# EAGLE schematic jnode_v3 (EAGLE 6.1)
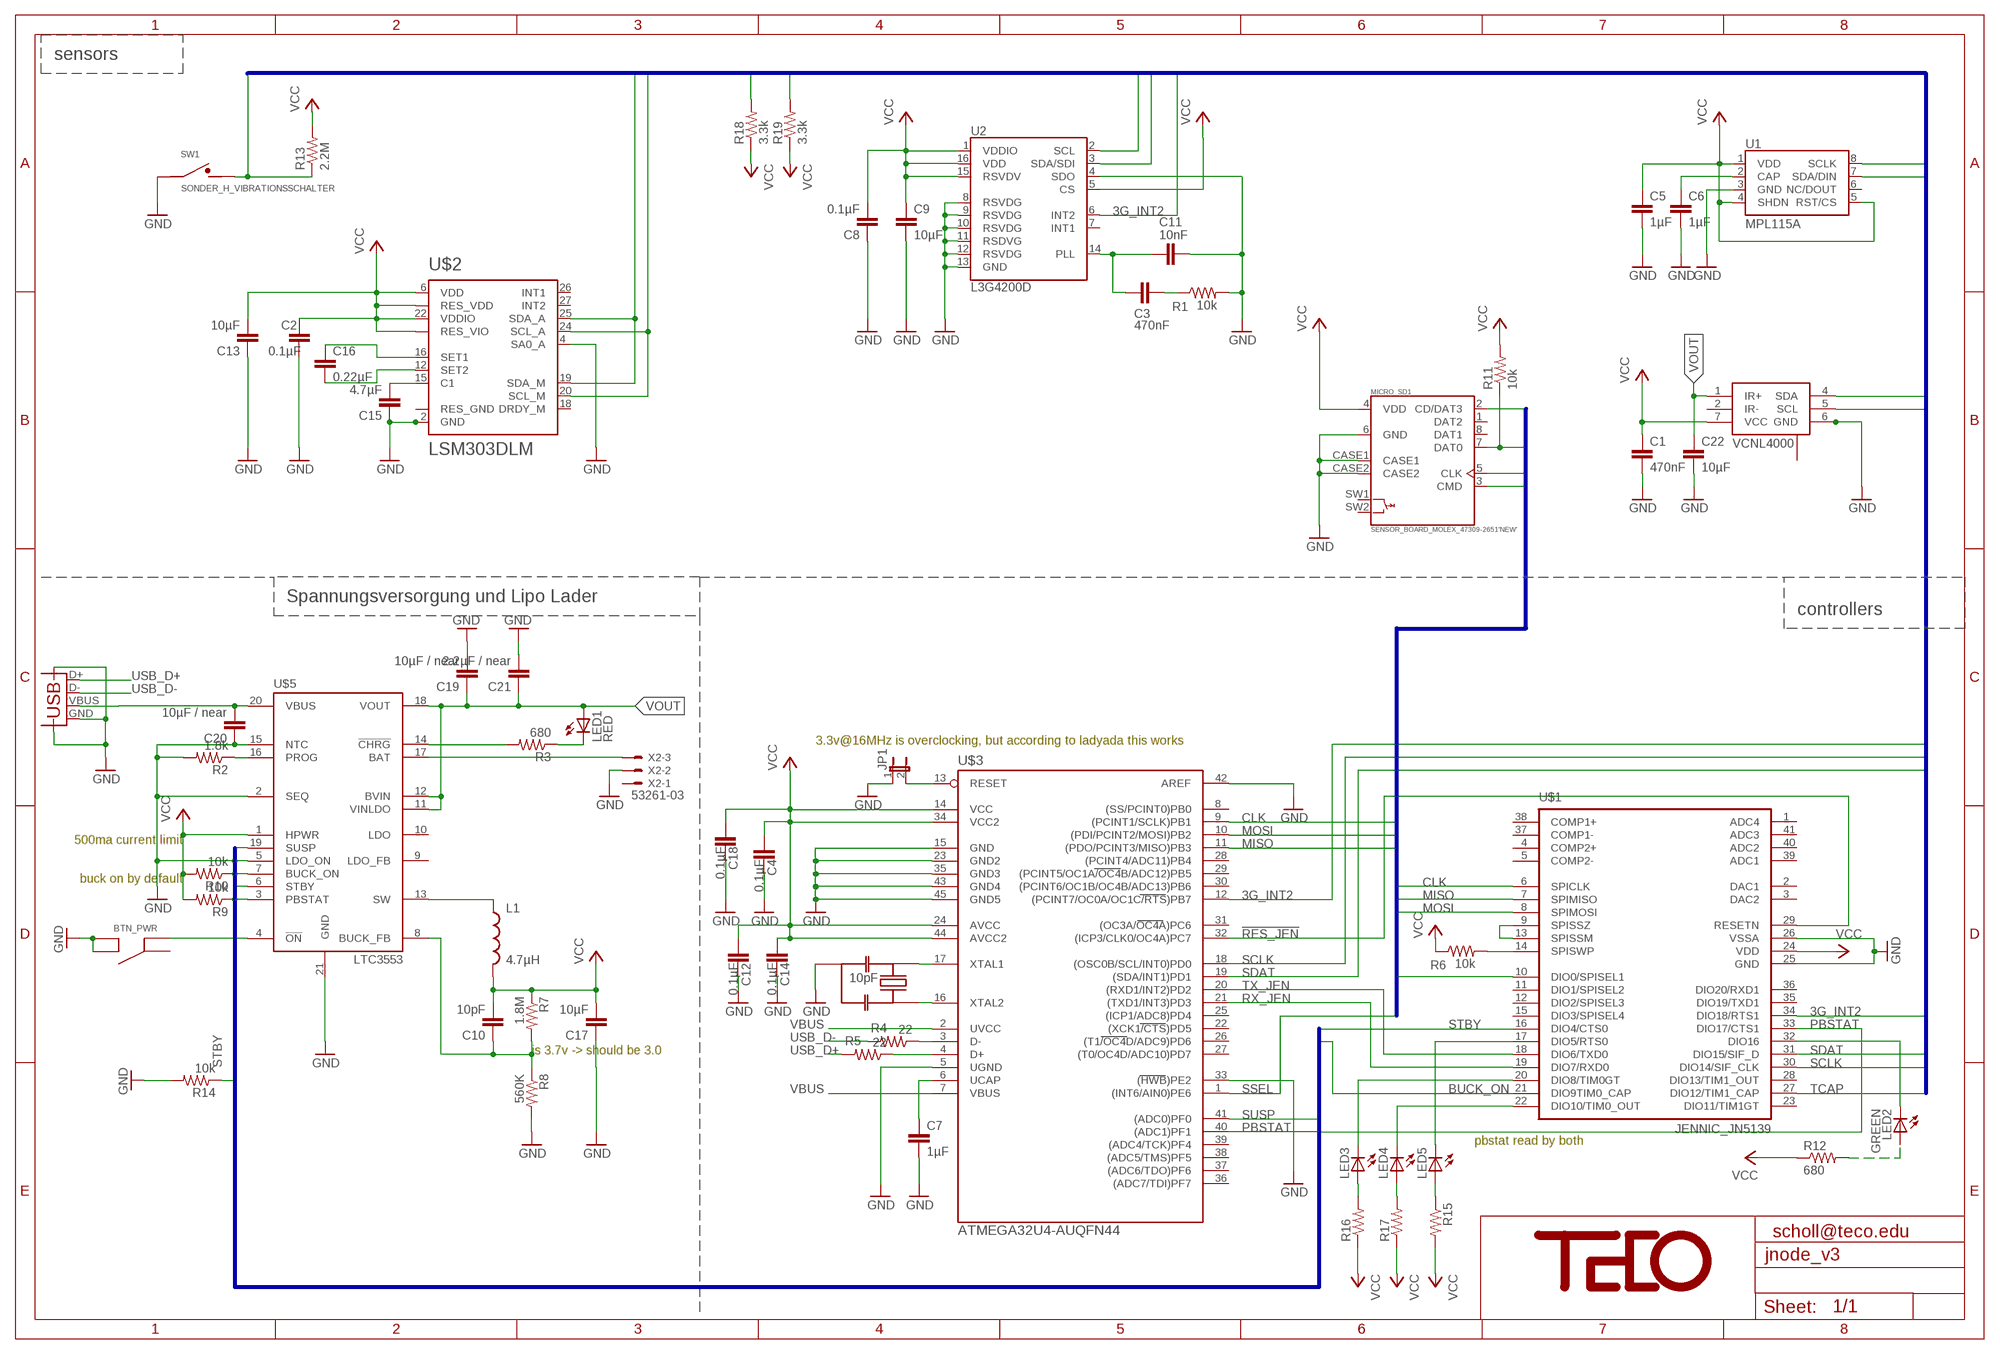
[diagram p0: schematic, sheet 1]

## Parts
BTN_PWR  TACTILE_SWITCH  [EVQ-PUK02K]
C1  470nF  CAP0402-CAP  [0402-CAP]
C2  0.1µF  CAP0402-CAP  [0402-CAP]
C3  470nF  CAP0402-CAP  [0402-CAP]
C4  0.1µF  CAP0402-CAP  [0402-CAP]
C5  1µF  CAP0402-CAP  [0402-CAP]
C6  1µF  CAP0402-CAP  [0402-CAP]
C7  1µF  CAP0402-CAP  [0402-CAP]
C8  0.1µF  CAP0402-CAP  [0402-CAP]
C9  10µF  CAP0603-CAP  [0603-CAP]
C10  10pF  CAP0402-CAP  [0402-CAP]
C11  10nF  CAP0402-CAP  [0402-CAP]
C12  0.1µF  CAP0402-CAP  [0402-CAP]
C13  10µF  CAP0603-CAP  [0603-CAP]
C14  0.1µF  CAP0402-CAP  [0402-CAP]
C15  4.7µF  CAP0402-CAP  [0402-CAP]
C16  0.22µF  CAP0402-CAP  [0402-CAP]
C17  10µF  CAP0603-CAP  [0603-CAP]
C18  0.1µF  CAP0402-CAP  [0402-CAP]
C19  10µF / near  CAP0603-CAP  [0603-CAP]
C20  10µF / near  CAP0603-CAP  [0603-CAP]
C21  2.2µF / near  CAP0402-CAP  [0402-CAP]
C22  10µF  CAP0603-CAP  [0603-CAP]
JP1  JUMPER-2SMD-NO  [SJ_2S-NO]
L1  4.7µH  SPARKFUN_INDUCTOR  [MLP2012]
LED1  RED  LEDCHIP-LED0402  [CHIP-LED0402]
LED2  GREEN  LEDCHIP-LED0402  [CHIP-LED0402]
LED3  LEDGL100MD1MP1  [GL100MD1MP1]
LED4  LEDGL100MD1MP1  [GL100MD1MP1]
LED5  LEDGL100MD1MP1  [GL100MD1MP1]
MICRO_SD1  SENSOR_BOARD_MOLEX_47309-2651'NEW'  [SENSOR_BOARD_MOLEX_47309-2651]
R1  10k  RESISTOR0402-RES  [0402-RES]
R2  1.8k  RESISTOR0402-RES  [0402-RES]
R3  680  RESISTOR0402-RES  [0402-RES]
R4  22  RESISTOR0402-RES  [0402-RES]
R5  22  RESISTOR0402-RES  [0402-RES]
R6  10k  RESISTOR0402-RES  [0402-RES]
R7  1.8M  RESISTOR0402-RES  [0402-RES]
R8  560K  RESISTOR0402-RES  [0402-RES]
R9  10k  RESISTOR0402-RES  [0402-RES]
R10  10k  RESISTOR0402-RES  [0402-RES]
R11  10k  RESISTOR0402-RES  [0402-RES]
R12  680  RESISTOR0402-RES  [0402-RES]
R13  2.2M  RESISTOR  [0805]
R14  10k  RESISTOR0402-RES  [0402-RES]
R15  RESISTOR0402-RES  [0402-RES]
R16  RESISTOR0402-RES  [0402-RES]
R17  RESISTOR0402-RES  [0402-RES]
R18  3.3k  RESISTOR0402-RES  [0402-RES]
R19  3.3k  RESISTOR0402-RES  [0402-RES]
SW1  SONDER_H_VIBRATIONSSCHALTER  [SONDER_H_VIBSCHALTER]
U1  MPL115A  [LGA8]
U2  L3G4200D  [LGA16-4X4]
U$1  JENNIC_JN5139  JENNIC_JN51XXSMDTH  [JN5148_SMDTH]
U$2  LSM303DLM  LSM303LGA28_LONG  [LGA28]
U$3  ATMEGA32U4-AUQFN44  [QFN44]
U$5  LTC3553  [QFN20]
U$6  RESONATORPRQC-S  [PRQC]
U$9  TECO-LOGO  [TECO-LOGO]
VCNL4000  VCNL4000  [VNCL4000]
X1  USB-MICROB  [USB-MICROB]
X2  53261-03  [53261-03]

## Nets
3G_INT2: U2.6(INT2) U$1.34(DIO18/RTS1) U$3.12((PCINT7/OC0A/OC1C/RTS)PB7)
!RES_JEN: U$1.29(RESETN) U$3.32((ICP3/CLK0/OC4A)PC7)
BUCK_FB: C10.1 R7.2 R8.1 U$5.8(BUCK_FB)
BUCK_ON: R10.1 U$1.21(DIO9TIM0_CAP) U$5.7(BUCK_ON)
CLK: MICRO_SD1.5(CLK) U$1.6(SPICLK) U$3.9((PCINT1/SCLK)PB1)
GND: BTN_PWR.2(B) BTN_PWR.4(B) C1.2 C2.2 C4.1 C5.2 C6.2 C7.2 C8.1 C9.2 C11.1 C12.1 C13.1 C14.1 C15.1 C17.1 C18.1 C19.2 C20.1 C21.2 C22.2 JP1.1 MICRO_SD1.6(GND) MICRO_SD1.CASE1 MICRO_SD1.CASE2 R1.2 R2.2 R8.2 R14.2 SW1.1 U1.3(GND) U2.4(SDO) U2.8(RSVDG) U2.9(RSVDG) U2.10(RSVDG) U2.11(RSDVG) U2.12(RSVDG) U2.13(GND) U$1.25(GND) U$1.26(VSSA) U$2.2(GND) U$2.4(SA0_A) U$3.5(UGND) U$3.15(GND) U$3.23(GND2) U$3.33((HWB)PE2) U$3.35(GND3) U$3.42(AREF) U$3.43(GND4) U$3.45(GND5) U$5.2(SEQ) U$5.5(LDO_ON) U$5.15(NTC) U$5.21(GND) U$6.GND VCNL4000.6(GND) VCNL4000.12(GND) X1.GND X1.GND@2(CASE) X1.GND@3(CASE) X2.2
LEDRED: LED2.P$2(C) U$1.32(DIO16)
MISO: MICRO_SD1.7(DAT0) R11.1 U$1.7(SPIMISO) U$3.11((PDO/PCINT3/MISO)PB3)
MOSI: MICRO_SD1.3(CMD) U$1.8(SPIMOSI) U$3.10((PDI/PCINT2/MOSI)PB2)
N$1: R4.1 U$3.3(D-)
N$2: C16.1 U$2.16(SET1)
N$3: R5.1 U$3.4(D+)
N$4: C7.1 U$3.6(UCAP)
N$5: R2.1 U$5.16(PROG)
N$6: VCNL4000.2(IR-) VCNL4000.3(IR-)
N$7: LED5.2(C) U$1.17(DIO5/RTS0)
N$8: C16.2 U$2.12(SET2)
N$9: BTN_PWR.3(A) U$5.4(!ON)
N$10: C6.1 U1.2(CAP)
N$11: LED1.P$2(C) R3.1
N$12: R3.2 U$5.14(!CHRG)
N$13: U$1.9(SPISSZ) U$1.13(SPISSM)
N$14: R6.2 U$1.14(SPISWP)
N$16: U$3.17(XTAL1) U$6.2
N$17: U$3.16(XTAL2) U$6.1
N$25: C15.2 U$2.15(C1)
N$26: C3.1 C11.2 U2.14(PLL)
N$27: C3.2 R1.1
N$29: LED2.P$1(A) R12.2
N$31: LED3.2(C) U$1.20(DIO8/TIM0GT)
N$32: LED3.1(A) R16.2
N$33: LED5.1(A) R15.1
N$34: LED4.2(C) U$1.22(DIO10/TIM0_OUT)
N$35: LED4.1(A) R17.2
PBSTAT: R9.1 U$1.33(DIO17/CTS1) U$3.40((ADC1)PF1) U$5.3(PBSTAT)
RX_JEN: U$1.19(DIO7/RXD0) U$3.21((TXD1/INT3)PD3)
SCLK: R19.2 U1.8(SCLK) U2.2(SCL) U$1.30(DIO14/SIF_CLK) U$2.20(SCL_M) U$2.24(SCL_A) U$3.18((OSC0B/SCL/INT0)PD0) VCNL4000.5(SCL)
SDAT: R18.2 U1.7(SDA/DIN) U2.3(SDA/SDI) U$1.31(DIO15/SIF_D) U$2.19(SDA_M) U$2.25(SDA_A) U$3.19((SDA/INT1)PD1) VCNL4000.4(SDA)
SHWO: JP1.2 U$3.13(RESET)
SSEL: MICRO_SD1.2(CD/DAT3) U$1.10(DIO0/SPISEL1) U$3.1((INT6/AIN0)PE6)
STBY: R14.1 U$1.16(DIO4/CTS0) U$5.6(STBY)
SUSP: U$3.41((ADC0)PF0) U$5.19(SUSP)
SW: L1.P$1 U$5.13(SW)
TCAP: R13.1 SW1.2 U$1.27(DIO12/TIM1_CAP)
TX_JEN: U$1.18(DIO6/TXD0) U$3.20((RXD1/INT2)PD2)
USB_D+: R5.2 X1.D+
USB_D-: R4.2 X1.D-
VBATT: U$5.17(BAT) X2.3
VBUS: C20.2 U$3.2(UVCC) U$3.7(VBUS) U$5.20(VBUS) X1.VBUS
VCC: C1.1 C2.1 C4.2 C5.1 C8.2 C9.1 C10.2 C12.2 C13.2 C14.2 C17.2 C18.2 L1.P$2 MICRO_SD1.4(VDD) R6.1 R7.1 R9.2 R10.2 R11.2 R12.1 R13.2 R15.2 R16.1 R17.1 R18.1 R19.1 U1.1(VDD) U1.4(SHDN) U1.5(RST/CS) U2.1(VDDIO) U2.5(CS) U2.15(RSVDV) U2.16(VDD) U$1.24(VDD) U$2.6(VDD) U$2.7(RES_VDD) U$2.22(VDDIO) U$2.23(RES_VIO) U$3.14(VCC) U$3.24(AVCC) U$3.34(VCC2) U$3.44(AVCC2) U$5.1(HPWR) VCNL4000.7(VCC)
VOUT: C19.1 C21.1 C22.1 LED1.P$1(A) U$5.11(VINLDO) U$5.12(BVIN) U$5.18(VOUT) VCNL4000.1(IR+)
Unconnected: BTN_PWR.1(A) MICRO_SD1.1(DAT2) MICRO_SD1.8(DAT1) MICRO_SD1.SW1 MICRO_SD1.SW2 U1.6(NC/DOUT) U2.7(INT1) U$1.1(ADC4) U$1.2(DAC1) U$1.3(DAC2) U$1.4(COMP2+) U$1.5(COMP2-) U$1.11(DIO1/SPISEL2) U$1.12(DIO2/SPISEL3) U$1.15(DIO3/SPISEL4) U$1.23(DIO11/TIM1GT) U$1.28(DIO13/TIM1_OUT) U$1.35(DIO19/TXD1) U$1.36(DIO20/RXD1) U$1.37(COMP1-) U$1.38(COMP1+) U$1.39(ADC1) U$1.40(ADC2) U$1.41(ADC3) U$2.1(RES_GND) U$2.3(RES_GND) U$2.17(RES_GND) U$2.18(DRDY_M) U$2.26(INT1) U$2.27(INT2) U$2.28(RES_GND) U$3.8((SS/PCINT0)PB0) U$3.22((XCK1/CTS)PD5) U$3.25((ICP1/ADC8)PD4) U$3.26((T1/OC4D/ADC9)PD6) U$3.27((T0/OC4D/ADC10)PD7) U$3.28((PCINT4/ADC11)PB4) U$3.29((PCINT5/OC1A/OC4B/ADC12)PB5) U$3.30((PCINT6/OC1B/OC4B/ADC13)PB6) U$3.31((OC3A/OC4A)PC6) U$3.36((ADC7/TDI)PF7) U$3.37((ADC6/TDO)PF6) U$3.38((ADC5/TMS)PF5) U$3.39((ADC4/TCK)PF4) U$5.9(LDO_FB) U$5.10(LDO) VCNL4000.8(NC) VCNL4000.9(NC) VCNL4000.10(NC) VCNL4000.11(NC) X2.1

## Buses
PWRCTRL:BUCK_ON,STBY,PBSTAT,SUSP
SPI:SSEL,MISO,MOSI,CLK
I2C:SCLK,SDAT,TCAP,INT1,3G_INT2

## Notes on the sheet
- sensors
- Spannungsversorgung und Lipo Lader
- controllers
- 3.3v@16MHz is overclocking, but according to ladyada this works
- 500ma current limit
- buck on by default
- 10pF
- is 3.7v -> should be 3.0
- pbstat read by both
- scholl@teco.edu

## Library data of the parts
BTN_PWR = jnode:TACTILE_SWITCH: collection of tactile switches; DIGIKEY: http://search.digikey.com/scripts/DkSearch/dksus.dll?Detail&name=P10852SCT-ND
C1 C3 = sparkfun:CAP: Capacitor Standard 0603 ceramic capacitor, and 0.1" leaded capacitor.; DIGIKEY: http://search.digikey.com/scripts/DkSearch/dksus.dll?Detail&name=311-1334-1-ND; FARNELL: http://de.farnell.com/multicomp/mcca000510/mlcc-0402-x5r-16v-0-047uf/dp/1759386; TECO: yes
C2 = sparkfun:CAP: Capacitor Standard 0603 ceramic capacitor, and 0.1" leaded capacitor.; DIGIKEY: http://search.digikey.com/scripts/DkSearch/dksus.dll?Detail&name=445-7396-1-ND; FARNELL: http://de.farnell.com/multicomp/mcca000051/mlcc-04025v-16v-100nf/dp/1758897; TECO: yes
C4 C18 = sparkfun:CAP: Capacitor Standard 0603 ceramic capacitor, and 0.1" leaded capacitor.; DIGIKEY: http://search.digikey.com/scripts/DkSearch/dksus.dll?Detail&name=490-1318-1-ND; FARNELL: http://de.farnell.com/multicomp/mcca000051/mlcc-04025v-16v-100nf/dp/1758897; PLACE: no; TECO: yes
C5-C7 = sparkfun:CAP: Capacitor Standard 0603 ceramic capacitor, and 0.1" leaded capacitor.; DIGIKEY: http://search.digikey.com/scripts/DkSearch/dksus.dll?Detail&name=490-1320-1-ND; FARNELL: http://de.farnell.com/multicomp/mcca000500/mlcc-0402-x5r-6-3v-1uf/dp/1759375; TECO: yes
C8 C12 C14 = sparkfun:CAP: Capacitor Standard 0603 ceramic capacitor, and 0.1" leaded capacitor.; DIGIKEY: http://search.digikey.com/scripts/DkSearch/dksus.dll?Detail&name=490-1318-1-ND; FARNELL: http://de.farnell.com/multicomp/mcca000051/mlcc-04025v-16v-100nf/dp/1758897; TECO: yes
C9 C19 C20 = sparkfun:CAP: Capacitor Standard 0603 ceramic capacitor, and 0.1" leaded capacitor.; DIGIKEY: http://search.digikey.com/scripts/DkSearch/dksus.dll?Detail&name=445-7454-1-ND; FARNELL: http://de.farnell.com/multicomp/mcca000517/mlcc-0603-x5r-6-3v-10uf/dp/1759393; TECO: yes
C10 = sparkfun:CAP: Capacitor Standard 0603 ceramic capacitor, and 0.1" leaded capacitor.; DIGIKEY: http://search.digikey.com/scripts/DkSearch/dksus.dll?Detail&name=311-1014-1-ND; FARNELL: http://de.farnell.com/multicomp/mcca000091/mlcc-0402-np0-50v-10pf/dp/1758941; TECO: yes
C11 = sparkfun:CAP: Capacitor Standard 0603 ceramic capacitor, and 0.1" leaded capacitor.; DIGIKEY: http://search.digikey.com/scripts/DkSearch/dksus.dll?Detail&name=478-1114-1-ND; FARNELL: http://de.farnell.com/multicomp/mcca000076/mlcc-0402-x7r-25v-10nf/dp/1758924; TECO: yes
C13 = sparkfun:CAP: Capacitor Standard 0603 ceramic capacitor, and 0.1" leaded capacitor.; FARNELL: http://de.farnell.com/multicomp/mcca000517/mlcc-0603-x5r-6-3v-10uf/dp/1759393; TECO: yes
C15 = sparkfun:CAP: Capacitor Standard 0603 ceramic capacitor, and 0.1" leaded capacitor.; DIGIKEY: http://search.digikey.com/scripts/DkSearch/dksus.dll?Detail&name=490-5408-1-ND; FARNELL: http://de.farnell.com/avx/04024d475mat2a/kondensator-0402-x5r-4v-4-7uf/dp/1833801; TECO: yes
C16 = sparkfun:CAP: Capacitor Standard 0603 ceramic capacitor, and 0.1" leaded capacitor.; DIGIKEY: http://search.digikey.com/scripts/DkSearch/dksus.dll?Detail&name=311-1350-1-ND; FARNELL: http://de.farnell.com/multicomp/mcca000036/mlcc-04025v-10v-220nf/dp/1758880; TECO: yes
C17 C22 = sparkfun:CAP: Capacitor Standard 0603 ceramic capacitor, and 0.1" leaded capacitor.; DIGIKEY: http://search.digikey.com/scripts/DkSearch/dksus.dll?Detail&name=311-1014-1-ND; FARNELL: http://de.farnell.com/multicomp/mcca000517/mlcc-0603-x5r-6-3v-10uf/dp/1759393; TECO: yes
C21 = sparkfun:CAP: Capacitor Standard 0603 ceramic capacitor, and 0.1" leaded capacitor.; DIGIKEY: http://search.digikey.com/scripts/DkSearch/dksus.dll?Detail&name=445-7396-1-ND; FARNELL: http://de.farnell.com/multicomp/mcca000501/mlcc-0402-x5r-6-3v-2-2uf/dp/1759376RL; TECO: yes
JP1 = sparkfun:JUMPER-2: Jumper Basic 0.1" spaced jumper. Use with breakaway headers.
L1 = jnode:SPARKFUN_INDUCTOR: Inductors Basic Inductor/Choke - 0603 and 1206. Footprints are not proven and vary greatly between part numbers.; DIGIKEY: http://search.digikey.com/scripts/DkSearch/dksus.dll?Detail&name=445-6366-1-ND
LED1 LED2 = jnode:LED: LED OSRAM: - CHIPLED LG R971, LG N971, LY N971, LG Q971, LY Q971, LO R971, LY R971 LH N974, LH R974 LS Q976, LO Q976, LY Q976 LO Q996 - Hyper CHIPLED LW Q18S LB Q993, LB Q99A, LB R99A - SideLED LS A670, LO A670, LY A670, LG A670, LP A670 LB A673, LV A673, LT A673, LW A673 LH A674 LY A675 LS A676, LA A676, LO A676, LY A676, LW A676 LS A679, LY A679, LG A679 - Hyper Micro SIDELED® LS Y876, LA Y876, LO Y876, LY Y876 LT Y87S - SmartLED LW L88C, LW L88S LB L89C, LB L89S, LG L890 LS L89K, LO L89K, LY L89K LS L896, LA L896, LO L896, LY L896 - TOPLED LS T670, LO T670, LY T670, LG T670, LP T670 LSG T670, LSP T670, LSY T670, LOP T670, LYG T670 LG T671, LOG T671, LSG T671 LB T673, LV T673, LT T673, LW T673 LH T674 LS T676, LA T676, LO T676, LY T676, LB T676, LH T676, LSB T676, LW T676 LB T67C, LV T67C, LT T67C, LS T67K, LO T67K, LY T67K, LW E67C LS E67B, LA E67B, LO E67B, LY E67B, LB E67C, LV E67C, LT E67C LW T67C LS T679, LY T679, LG T679 LS T770, LO T770, LY T770, LG T770, LP T770 LB T773, LV T773, LT T773, LW T773 LH T774 LS E675, LA E675, LY E675, LS T675 LS T776, LA T776, LO T776, LY T776, LB T776 LHGB T686 LT T68C, LB T68C - Hyper Mini TOPLED® LB M676 - Mini TOPLED Santana® LG M470 LS M47K, LO M47K, LY M47K Source: http://www.osram.convergy.de LUXEON: - LUMILED® LXK2-PW12-R00, LXK2-PW12-S00, LXK2-PW14-U00, LXK2-PW14-V00 LXK2-PM12-R00, LXK2-PM12-S00, LXK2-PM14-U00 LXK2-PE12-Q00, LXK2-PE12-R00, LXK2-PE12-S00, LXK2-PE14-T00, LXK2-PE14-U00 LXK2-PB12-K00, LXK2-PB12-L00, LXK2-PB12-M00, LXK2-PB14-N00, LXK2-PB14-P00, LXK2-PB14-Q00 LXK2-PR12-L00, LXK2-PR12-M00, LXK2-PR14-Q00, LXK2-PR14-R00 LXK2-PD12-Q00, LXK2-PD12-R00, LXK2-PD12-S00 LXK2-PH12-R00, LXK2-PH12-S00 LXK2-PL12-P00, LXK2-PL12-Q00, LXK2-PL12-R00 Source: www.luxeon.com KINGBRIGHT: KA-3528ASYC Source: www.kingbright.com; DIGIKEY: http://search.digikey.com/scripts/DkSearch/dksus.dll?Detail&name=754-1128-1-ND; TECO: yes
LED3-LED5 = jnode:LED: LED OSRAM: - CHIPLED LG R971, LG N971, LY N971, LG Q971, LY Q971, LO R971, LY R971 LH N974, LH R974 LS Q976, LO Q976, LY Q976 LO Q996 - Hyper CHIPLED LW Q18S LB Q993, LB Q99A, LB R99A - SideLED LS A670, LO A670, LY A670, LG A670, LP A670 LB A673, LV A673, LT A673, LW A673 LH A674 LY A675 LS A676, LA A676, LO A676, LY A676, LW A676 LS A679, LY A679, LG A679 - Hyper Micro SIDELED® LS Y876, LA Y876, LO Y876, LY Y876 LT Y87S - SmartLED LW L88C, LW L88S LB L89C, LB L89S, LG L890 LS L89K, LO L89K, LY L89K LS L896, LA L896, LO L896, LY L896 - TOPLED LS T670, LO T670, LY T670, LG T670, LP T670 LSG T670, LSP T670, LSY T670, LOP T670, LYG T670 LG T671, LOG T671, LSG T671 LB T673, LV T673, LT T673, LW T673 LH T674 LS T676, LA T676, LO T676, LY T676, LB T676, LH T676, LSB T676, LW T676 LB T67C, LV T67C, LT T67C, LS T67K, LO T67K, LY T67K, LW E67C LS E67B, LA E67B, LO E67B, LY E67B, LB E67C, LV E67C, LT E67C LW T67C LS T679, LY T679, LG T679 LS T770, LO T770, LY T770, LG T770, LP T770 LB T773, LV T773, LT T773, LW T773 LH T774 LS E675, LA E675, LY E675, LS T675 LS T776, LA T776, LO T776, LY T776, LB T776 LHGB T686 LT T68C, LB T68C - Hyper Mini TOPLED® LB M676 - Mini TOPLED Santana® LG M470 LS M47K, LO M47K, LY M47K Source: http://www.osram.convergy.de LUXEON: - LUMILED® LXK2-PW12-R00, LXK2-PW12-S00, LXK2-PW14-U00, LXK2-PW14-V00 LXK2-PM12-R00, LXK2-PM12-S00, LXK2-PM14-U00 LXK2-PE12-Q00, LXK2-PE12-R00, LXK2-PE12-S00, LXK2-PE14-T00, LXK2-PE14-U00 LXK2-PB12-K00, LXK2-PB12-L00, LXK2-PB12-M00, LXK2-PB14-N00, LXK2-PB14-P00, LXK2-PB14-Q00 LXK2-PR12-L00, LXK2-PR12-M00, LXK2-PR14-Q00, LXK2-PR14-R00 LXK2-PD12-Q00, LXK2-PD12-R00, LXK2-PD12-S00 LXK2-PH12-R00, LXK2-PH12-S00 LXK2-PL12-P00, LXK2-PL12-Q00, LXK2-PL12-R00 Source: www.luxeon.com KINGBRIGHT: KA-3528ASYC Source: www.kingbright.com; FARNELL: http://de.farnell.com/sharp/gl100md1mp1/ir-emitter-smd-940nm/dp/9707816?Ntt=970-7816; PLACE: no
MICRO_SD1 = teco_div:SENSOR_BOARD_MOLEX_47309-2651; DIGIKEY: http://search.digikey.com/scripts/DkSearch/dksus.dll?Detail&name=WM3974CT-ND; TECO: yes
R1 R6 R9-R11 R14 = sparkfun:RESISTOR: Resistor Basic schematic elements and footprints for 0603, 1206, and PTH 1/10th watt (small) resistors.; DIGIKEY: http://search.digikey.com/scripts/DkSearch/dksus.dll?Detail&name=311-10KJRCT-ND; FARNELL: http://de.farnell.com/bourns/cr0603-jw-103elf/widerstand-0603-10k-5-0-1w/dp/2008360; TECO: yes
R2 = sparkfun:RESISTOR: Resistor Basic schematic elements and footprints for 0603, 1206, and PTH 1/10th watt (small) resistors.; DIGIKEY: http://search.digikey.com/scripts/DkSearch/dksus.dll?Detail&name=311-1.8KJRCT-ND; FARNELL: http://de.farnell.com/vishay-draloric/crcw04021k80fkeahp/widerstand-0402-1-1k80/dp/1738853; TECO: yes
R3 = sparkfun:RESISTOR: Resistor Basic schematic elements and footprints for 0603, 1206, and PTH 1/10th watt (small) resistors.; DIGIKEY: http://search.digikey.com/scripts/DkSearch/dksus.dll?Detail&name=311-39JRCT-ND
R4 R5 = sparkfun:RESISTOR: Resistor Basic schematic elements and footprints for 0603, 1206, and PTH 1/10th watt (small) resistors.; DIGIKEY: http://search.digikey.com/scripts/DkSearch/dksus.dll?Detail&name=311-22JRCT-ND; FARNELL: http://de.farnell.com/multicomp/mc-0-0625w-0402-1-22r/widerstand-0402-1-22r/dp/1357998
R7 = sparkfun:RESISTOR: Resistor Basic schematic elements and footprints for 0603, 1206, and PTH 1/10th watt (small) resistors.; DIGIKEY: http://search.digikey.com/scripts/DkSearch/dksus.dll?Detail&name=541-2.20MLCT-ND; FARNELL: http://de.farnell.com/yageo-phycomp/rc0402fr-071m8l/widerstand-0402-0-063w-1-1m8/dp/1458753; TECO: yes
R8 = sparkfun:RESISTOR: Resistor Basic schematic elements and footprints for 0603, 1206, and PTH 1/10th watt (small) resistors.; DIGIKEY: http://search.digikey.com/scripts/DkSearch/dksus.dll?Detail&name=RMCF0402FT698KCT-ND; FARNELL: http://de.farnell.com/yageo-phycomp/rc0402jr-07560kl/widerstand-rc31-0402-560k/dp/9233091
R12 = sparkfun:RESISTOR: Resistor Basic schematic elements and footprints for 0603, 1206, and PTH 1/10th watt (small) resistors.
R13 = sparkfun:RESISTOR: Resistor Basic schematic elements and footprints for 0603, 1206, and PTH 1/10th watt (small) resistors.; DIGIKEY: http://search.digikey.com/scripts/DkSearch/dksus.dll?Detail&name=541-2.20MLCT-ND; FARNELL: http://de.farnell.com/te-connectivity-cgs/rh73u2a2m2jtd/widerstand-0805-2m2/dp/1174056
R15-R17 = sparkfun:RESISTOR: Resistor Basic schematic elements and footprints for 0603, 1206, and PTH 1/10th watt (small) resistors.; PLACE: no
R18 R19 = sparkfun:RESISTOR: Resistor Basic schematic elements and footprints for 0603, 1206, and PTH 1/10th watt (small) resistors.; DIGIKEY: http://search.digikey.com/scripts/DkSearch/dksus.dll?Detail&name=541-2.20MLCT-ND; FARNELL: http://de.farnell.com/bourns/cr0603-jw-103elf/widerstand-0603-10k-5-0-1w/dp/2008360; PLACE: no; TECO: yes
SW1 = jnode:SONDER_H_VIBRATIONSSCHALTER: Vibrationsschalter von FZK oder Signalquest SignalQuest, Inc. 1 Mechanic St. Lebanon, NH 03766 USA www.signalquest.com
U1 = mpl115:MPL115A: MPL115A1 (SPI) and MPL115A2 (I2C) Miniature Digital Barometer 5.0x3.0x1.2mm LGA Package; DIGIKEY: http://search.digikey.com/scripts/DkSearch/dksus.dll?Detail&name=MPL115A2T1CT-ND; TECO: yes
U2 = sparkfun:L3G4200D: L3G4200D Three-axis, digital output gyroscope The L3G4200D is a low-power three-axis angular rate sensor, has a full scale of ±250/±500/±2000 dps and is capable of measuring rates with a user-selectable bandwidth. It includes a sensing element and an IC interface capable of providing the measured angular rate to the external world through a digital interface (I2C/SPI). Package: 4x4x1.1 LGA-16 (LGA16-4x4.PAC); DIGIKEY: http://search.digikey.com/scripts/DkSearch/dksus.dll?Detail&name=497-11071-1-ND; FARNELL: http://de.farnell.com/stmicroelectronics/l3g4200d/gyro-mems-3achsen-16llga-16lga/dp/1872924?Ntt=l3g4200; FUTUREELECTRIC: http://de.futureelectronics.com/de/technologies/semiconductors/analog/sensors/motion/Seiten/2007852-L3G4200DTR.aspx
U$1 = jnode:JENNIC_JN51XX: JN5139-xxx-M00xxx, Farnell: 1500175; DIGIKEY: http://search.digikey.com/de/de/products/JN5148%2F001M00T,534/616-1045-1-ND/2139684; FUTUREELECTRIC: http://de.futureelectronics.com/de/technologies/semiconductors/microcontrollers/32-bit/Seiten/6004977-JN5148-001M00T,534.aspx; TECO: yes
U$2 = jnode:LSM303: LSM303DLH ? 3-axis accelerometer and 3-axis magnetometer ? Digital supply voltage IOs: 1.8 V ? Power-down mode ? ±1.3 to ±8,1 gauss magnetic field full-scale ? ±2 g/±4 g/±8 g dynamically selectable fullscale ? 16-bit data out ? I2C serial interface http://www.st.com/stonline/products/literature/ds/16941/lsm303dlh.pdf; DIGIKEY: http://search.digikey.com/scripts/DkSearch/dksus.dll?Detail&name=497-11240-1-ND; FUTUREELECTRIC: http://de.futureelectronics.com/de/technologies/semiconductors/analog/sensors/accelerometers/Seiten/8010012-LSM303DLMTR.aspx
U$3 = jnode:ATMEGA32U4-AU; DIGIKEY: http://search.digikey.com/scripts/DkSearch/dksus.dll?Detail&name=ATMEGA32U4-MU-ND
U$5 = jnode:LTC3553; DIGIKEY: http://search.digikey.com/scripts/DkSearch/dksus.dll?Detail&name=LTC3553EUD%23PBF-ND
U$6 = jnode:RESONATOR: Ceramic Resonator with caps AWSCR-16.00CV-T: 16Mhz ceramic resonator with 22pF capacitors PRQC16.00SR5010X000: 16Mhz ceramic resonator with 10pF capacitors; DIGIKEY: http://search.digikey.com/scripts/DkSearch/dksus.dll?Detail&name=478-5420-1-ND
U$9 = teco_div:TECO-LOGO
VCNL4000 = VCNL4000:VCNL4000; DIGIKEY: http://search.digikey.com/scripts/DkSearch/dksus.dll?Detail&name=751-1505-1-ND; TECO: yes
X1 = sparkfun:USB: USB Connectors USB-B-PTH is fully proven SKU : PRT-00139 USB-miniB is fully proven SKU : PRT-00587 USB-A-PCB is untested. USB-A-H is throughly reviewed, but untested. Spark Fun Electronics SKU : PRT-00437 USB-B-SMT is throughly reviewed, but untested. Needs silkscreen touching up. USB-A-S has not been used/tested USB-MB-H has not been used/tested; DIGIKEY: http://search.digikey.com/scripts/DkSearch/dksus.dll?Detail&name=H11635CT-ND
X2 = con-molex:53?-03: CONNECTOR wire to board 1.25 mm (.049 inch) pitch header; IPODCONN: http://www.batteryspace.com/li-ionbatterymodule37v500mahwithpcb043144foripodmini185wh.aspx; MF: MOLEX; MPN: 53261-0390; OC_FARNELL: 1125359; OC_NEWARK: 57H5006